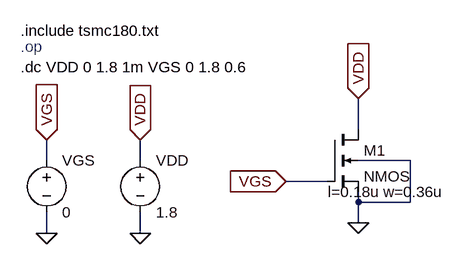
[diagram p0: schematic Id_Vds_Curve.asc]
Id_Vds_Curve.asc, the LTspice schematic file:
Version 4
SHEET 1 880 680
WIRE 432 176 432 128
WIRE -48 224 -48 192
WIRE 96 224 96 192
WIRE 512 224 432 224
WIRE 384 256 320 256
WIRE 432 288 432 272
WIRE 512 288 512 224
WIRE 512 288 432 288
WIRE 432 320 432 288
WIRE -48 336 -48 304
WIRE 96 336 96 304
FLAG 432 320 0
FLAG 96 336 0
FLAG -48 336 0
FLAG 320 256 VGS
IOPIN 320 256 In
FLAG 96 192 VDD
IOPIN 96 192 In
FLAG 432 128 VDD
IOPIN 432 128 In
FLAG -48 192 VGS
IOPIN -48 192 In
SYMBOL nmos4 384 176 R0
WINDOW 123 1 96 Left 2
SYMATTR InstName M1
SYMATTR Value2 l=0.18u w=0.36u
SYMBOL voltage 96 208 R0
WINDOW 123 0 0 Left 0
WINDOW 39 0 0 Left 0
SYMATTR InstName VDD
SYMATTR Value 1.8
SYMBOL voltage -48 208 R0
WINDOW 123 0 0 Left 0
WINDOW 39 0 0 Left 0
SYMATTR InstName VGS
SYMATTR Value 0
TEXT -88 24 Left 2 !.include tsmc180.txt
TEXT -88 48 Left 2 ;.op
TEXT -88 80 Left 2 !.dc VDD 0 1.8 1m VGS 0 1.8 0.6

The netlist it stands for:
* Id_Vds_Curve.asc
M1 VDD VGS 0 0 NMOS l=0.18u w=0.36u
VDD VDD 0 1.8
VGS VGS 0 0
.model NMOS NMOS
.model PMOS PMOS
.lib standard.mos
.include tsmc180.txt
* .op
.dc VDD 0 1.8 1m VGS 0 1.8 0.6
.backanno
.end